# Altium schematic sheet M.SchDoc
size A
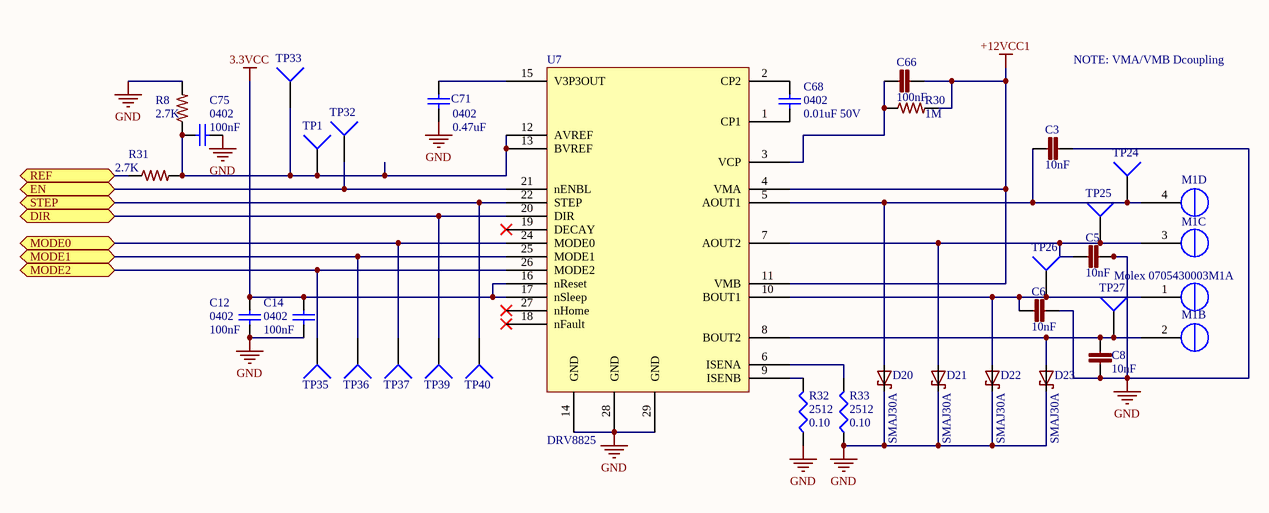
[diagram p0: M.SchDoc]

## Parts
C3  10nF  [C0603]
C5  10nF  [C0603]
C6  10nF  [C0603]
C8  10nF  [C0603]
C12  value 100nF  [C0402]  (hidden comment: 0402)
C14  value 100nF  [C0402]  (hidden comment: 0402)
C66  100nF  [C0603]
C68  value 0.01uF 50V  [C0402]  (hidden comment: 0402)
C71  value 0.47uF  [C0402]  (hidden comment: 0402)
C75  value 100nF  [C0402]  (hidden comment: 0402)
D20  SMAJ30A  [SMA-SM]
D21  SMAJ30A  [SMA-SM]
D22  SMAJ30A  [SMA-SM]
D23  SMAJ30A  [SMA-SM]
M1  Molex 0705430003  [4POL254]  (parts A,B,C,D of 4)
R8  2.7K  [R0402]
R30  1M  [R0402]
R31  2.7K  [R0402]
R32  2512  value 0.10  [2512R-0.55]
R33  2512  value 0.10  [2512R-0.55]
TP1  TP4  [TP-2]  (value not drawn)
TP24  TP4  [TP-2]  (value not drawn)
TP25  TP4  [TP-2]  (value not drawn)
TP26  TP4  [TP-2]  (value not drawn)
TP27  TP4  [TP-2]  (value not drawn)
TP32  TP4  [TP-2]  (value not drawn)
TP33  TP4  [TP-2]  (value not drawn)
TP35  TP4  [TP-2]  (value not drawn)
TP36  TP4  [TP-2]  (value not drawn)
TP37  TP4  [TP-2]  (value not drawn)
TP39  TP4  [TP-2]  (value not drawn)
TP40  TP4  [TP-2]  (value not drawn)
U7  DRV8825  [DRV8825PWPR]

## Ports
DIR, EN, MODE0, MODE1, MODE2, REF, STEP

## Nets
3.3VCC: C12.2 C14.2 U7.16(nReset) U7.17(nSleep)
+12VCC1: C66.2 R30.2 U7.4(VMA) U7.11(VMB)
GND: C3.2 C5.2 C6.2 C8.1 C12.1 C14.1 C71.1 C75.1 D20.C D21.C D22.C D23.C R8.2 R32.1 R33.1 U7.14(GND) U7.28(GND) U7.29(GND)
DIR: TP39.1 U7.20(DIR) ; port DIR
EN: TP32.1 U7.21(nENBL) ; port EN
MODE0: TP37.1 U7.24(MODE0) ; port MODE0
MODE1: TP36.1 U7.25(MODE1) ; port MODE1
MODE2: TP35.1 U7.26(MODE2) ; port MODE2
REF: R31.1 ; port REF
STEP: TP40.1 U7.22(STEP) ; port STEP
NetC3_1: C3.1 D20.A M1.4(OUT1B) TP24.1 U7.5(AOUT1)
NetC5_1: C5.1 D21.A M1.3(OUT1A) TP25.1 U7.7(AOUT2)
NetC6_1: C6.1 D22.A M1.1(OUT2B) TP26.1 U7.10(BOUT1)
NetC8_2: C8.2 D23.A M1.2(OUT2A) TP27.1 U7.8(BOUT2)
NetC66_1: C66.1 R30.1 U7.3(VCP)
NetC68_1: C68.1 U7.1(CP1)
NetC68_2: C68.2 U7.2(CP2)
NetC71_2: C71.2 U7.15(V3P3OUT)
NetC75_2: C75.2 R8.1 R31.2 TP1.1 TP33.1 U7.12(AVREF) U7.13(BVREF)
NetR32_2: R32.2 U7.9(ISENB)
NetR33_2: R33.2 U7.6(ISENA)

Not connected (* = marked no-connect by the designer): U7 18(nFault)* 19(DECAY)* 23(NC) 27(nHome)*

## Notes on the sheet
- NOTE: VMA/VMB Dcoupling

## Library data of the parts
C3 C5 C6 C8 = C1608X7R1E103K080AA: CAP CER 0603 10nF 25V 10% X7R; LastRevisionNote: ImportComponents; Published: 23-Apr-2014; Publisher: UltiMachine; LastRevisionDate: 23-Apr-2014; ManufacturerPartNumber: C1608X7R1E103K080AA; VALUE: 10nF
C12 C14 C75 = 100nF C0402 - GRM155R71C104KA88D: Capacitor (Semiconductor SIM Model); MFR: Murata; Part Description: CAP CER 0.1UF 16V 10% X7R 0402; Tolerance: 10%; Voltage: 16v; Published: 10 - Dec - 2014; LatestRevisionDate: 10 - Dec - 2014; LatestRevisionNote: Ultimachine Footprint Added; Publisher: Ultimachine; Component Type: Chip Capacitor; MFR Part #: GRM155R71C104KA88D; Mounting Type: SMT 0402; Datasheet: http://psearch.murata.com/capacitor/product/GRM155R71C104KA88%23.pdf; Height: 0.5 ±0.05mm; PackageReference: 0402
C66 = C0603C104K5RACTU: CAP CER 0603 100nF 50V 10% X7R; LastRevisionNote: ImportComponents; Published: 23-Apr-2014; Publisher: UltiMachine; LastRevisionDate: 23-Apr-2014; ManufacturerPartNumber: C0603C104K5RACTU; VALUE: 100nF
C68 = GRM155R71H103JA88D: CAP CER 10000PF 50V X7R 0402; MFR: Murata; Tolerance: 10%; Voltage: 6.3VDC; Published: 10 - Dec - 2014; LatestRevisionDate: 10 - Dec - 2014; LatestRevisionNote: Ultimachine Footprint Added; Publisher: Ultimachine; Component Type: Chip Capacitor; MFR Part #: GRM155R71H103JA88D; Part Description: CAP CER 10000PF 50V X7R 0402; Mounting Type: SMT 0402; Datasheet: http://search.murata.co.jp/Ceramy/image/img/A01X/G101/ENG/GRM155R71H103JA88-01.pdf; Height: 0.5 ±0.05mm; Digikey #: 490-7763-1-ND; PackageReference: 0402
C71 = GRM155R60J474KE19D: 0.47uF 6.3v C0402 - GRM155R60J474KE19D; MFR: Murata; Part Description: CAP CER 0.47UF 6.3V 10% X5R 0402; Tolerance: 10%; Voltage: 6.3VDC; Published: 10 - Dec - 2014; LatestRevisionDate: 10 - Dec - 2014; LatestRevisionNote: Ultimachine Footprint Added; Publisher: Ultimachine; Component Type: Chip Capacitor; MFR Part #: GRM155R60J474KE19D; Mounting Type: SMT 0402; Datasheet: http://search.murata.co.jp/Ceramy/image/img/A01X/G101/ENG/GRM155R60J474KE19-01.pdf; Height: 0.5 ±0.05mm; PackageReference: 0402
D20-D23 = SMAJ30A: DIODE TVS 30V SMA; LastRevisionNote: ImportComponents; Published: 23-Apr-2014; Publisher: UltiMachine; LastRevisionDate: 23-Apr-2014; ManufacturerPartNumber: SMAJ30A
M1 = Molex 0705430003 Alt: Molex 4 Pin Clip Connector
R8 R31 = ERJ-2RKF2701X: RES SMD 2.7K OHM 1% 1/10W 0402; Manufacturer: Panasonic; ManufacturerPartNumber: ERJ2GEJ105X; LastRevisionNote: ImportComponents; Published: 23-Apr-2014; Publisher: Adam; LastRevisionDate: 23-Apr-2014; VALUE: 2.7K
R30 = ERJ2GEJ105X: RES 0402 1M 100mW 5%; LastRevisionNote: ImportComponents; Published: 23-Apr-2014; Publisher: UltiMachine; LastRevisionDate: 23-Apr-2014; ManufacturerPartNumber: ERJ2GEJ105X; VALUE: 1M
R32 R33 = CSRN2512FTR100: RES SMD 0.1 OHM 1% 2W 2512; MFR: Stackpole ELectronics Inc; PackageReference: 2512; MFR #: CSRN2512FTR100; Digikey #: CSRN2512FTR100TR-ND; PDF: http://www.seielect.com/catalog/SEI-CSR_CSRN.pdf
TP1 TP24-TP27 TP32 TP33 TP35-TP37 TP39 TP40 = Socket: LatestRevisionDate: 17-Jul-2002; LatestRevisionNote: Re-released for DXP Platform.; Publisher: Altium Limited
U7 = DRV8825: DRV8825 Ti Stepper Driver; Manufacture: Texas Instruments; Mountining Type: SMD - Ti PowerPAD Package; Voltage: 8.2-45VDC; Cost (1000 qty): 2.25; Part Number: DRV8825PWPR; Status: In-Production; Pins: 28 Pins and one Exposed Pad; Datasheet: http://www.ti.com/lit/gpn/drv8825; Height: 1.2mm; Tolerance: N/A; Type: Stepper Driver - Integrated Circuit; Lead Free: YES